# Altium project CG_LNA.PrjPcb
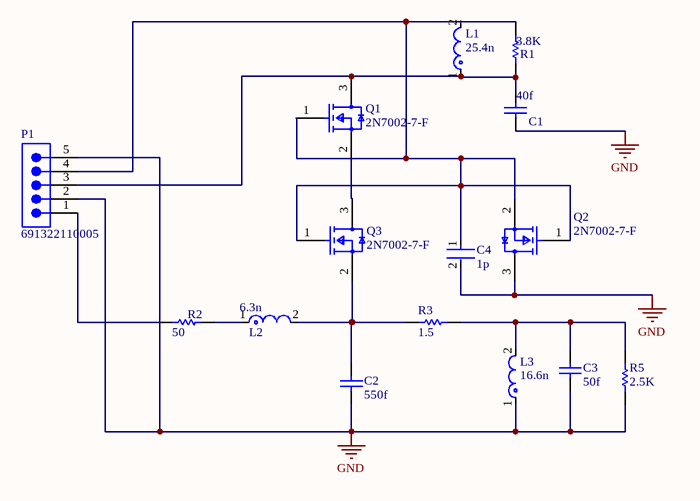
[diagram p0: Sheet1.SchDoc]
1 sheet, 15 parts. Net scope: global (net labels, ports and power ports of the same name join across sheets).
Board file: PCB2.PcbDoc

## Sheet Sheet1.SchDoc
size A; SheetNumber: 1; SheetTotal: 1

### Parts
C1  40f  [CAPC1005X55X25ML05T10]
C2  550f  [CAPC1005X55X25ML05T10]
C3  50f  [CAPC1608X90X35NL10T15]
C4  1p  [FP-GJM155-0_05-IPC_B]
L1  25.4n  [FP-LQP03TG_02-MFG]
L2  6.3n  [FP-LQP03TG_02-MFG]
L3  16.6n  [FP-LQP03TG_02-MFG]
P1  691322110005  [691322110005]
Q1  2N7002-7-F  [FP-SOT23-MFG]
Q2  2N7002-7-F  [FP-SOT23-MFG]
Q3  2N7002-7-F  [FP-SOT23-MFG]
R1  3.8K  [RESC1005X40X25LL05T05]
R2  50  [RESC1005X40X25LL05T05]
R3  1.5  [RESC1005X40X25LL05T05]
R5  2.5K  [RESC1005X40X25LL05T05]

### Nets
GND: C1.1 C2.1 C3.1 C4.2 L3.1 P1.2 P1.5 Q2.3(D) R5.1
NetC1_2: C1.2 L1.1 P1.3 Q1.3(D) R1.1
NetC2_2: C2.2 L2.2 Q3.2(S) R3.1
NetC3_2: C3.2 L3.2 R3.2 R5.2
NetC4_1: C4.1 P1.4 Q1.1(G) Q2.1(G) Q2.2(S) Q3.1(G) R1.2
NetL2_1: L2.1 R2.2
NetP1_1: P1.1 R2.1
NetQ1_2: Q1.2(S) Q3.3(D)

Not connected (* = marked no-connect by the designer): L1 2

### Library data of the parts
C1 C2 = CMP-2008-04284-1: Part Number: GRM1555C1H1R3CA01D; Manufacturer: Murata
C3 = CMP-2006-02422-1: Part Number: GQM1885C1H120JB01D; Manufacturer: Murata
C4 = CMP-2008-03808-2: Multi-Layer Ceramic Capacitor 1pF C0G  ±0.1pF 0402 Paper T/R; Temperature Coefficient: 30ppm/°C; Voltage Rating (DC): 50V; REACH SVHC: No SVHC; Packaging: Tape and Reel; Width: 0.02inch; Package Quantity: 10000; Min Operating Temperature: -55°C; Case Code (Imperial): 0402; Lead Pitch: 0.3mm; Capacitance: 1pF; Length: 1mm; Max Operating Temperature: 125°C; Depth: 0.5mm; Thickness: 0.022inch; Case Code (Metric): 1005; Lead Free: Lead Free; Voltage: 50V; Mount: Surface Mount; Number of Pins: 2; Termination: SMD/SMT; Radiation Hardening: No; Dielectric: C0G; Case/Package: 0402; Voltage Rating: 50V; Height: 0.5mm
L1-L3 = CMP-06042-014154-1: Film type RF Inductor 3.3nH ±0.1nH 450mA 0.25Ω 0201 (0603); Tolerance: 3%; DC Resistance (DCR): 250mR; Shielding: Unshielded; Q Factor: 14; Current: 300mA; Self Resonant Frequency: 8GHz; Test Frequency: 500MHz; Core Material: Non-Magnetic; Mount: Surface Mount; Radiation Hardening: No; Width: 0.012inch; Case Code (Imperial): 0201; Current Rating: 450mA; Height: 0.012inch; Height - Seated (Max): 0.013inch; Package Quantity: 15000; Termination: SMD/SMT; Inductance: 3.3nH; Max Operating Temperature: 125°C; DC Current: 450mA; Min Operating Temperature: -55°C; Max DC Current: 450mA; Packaging: Tape and Reel; Resistor Type: Thin Film; Case/Package: 0201; Case Code (Metric): 0603; Lead Free: Lead Free; Depth: 0.33mm; Length: 0.024inch; Military Standard: Not
P1 = CMP-1502-01794-2: NexarPartId: 18818349; Pitch: 3.5052mm; Current: 10A; Gender: Male; Number of Contacts: 5; Voltage: 300V; Number of Levels: 1; REACH SVHC: Unknown; Number of Rows: 1; Mount: Through Hole; Termination: Solder; Packaging: Box; Lead Pitch: 3.5mm; Contact Gender: Male; Number of Pins: 5; Contact Material: Brass; RoHS: Compliant; Color: Green; Length: 10.5mm; Width: 18.6mm; Number of Positions Per Level: 5; Height: 9.2mm
Q1-Q3 = CMP-2000-04929-2: MOSFET N-CH 60V 115MA SOT23-3; Turn-On Delay Time: 7ns; Turn-Off Delay Time: 11ns; Drain to Source Resistance: 7.5R; Rise Time: 3ns; Drain to Source Breakdown Voltage: 70V; Input Capacitance: 50pF; Number of Elements: 1; Power Dissipation: 540mW; Max Power Dissipation: 300mW; Fall Time: 5.6ns; Gate to Source Voltage (Vgs): 20V; Threshold Voltage: 2.5V; Element Configuration: Single; Termination: SMD/SMT; Weight: 0.000282oz; Radiation Hardening: No; Max Operating Temperature: 150°C; On-State Resistance: 7.5R; Mount: Surface Mount; Current Rating: 115mA; Contact Plating: Tin; Lead Free: Lead Free; Min Operating Temperature: -55°C; Number of Pins: 3; REACH SVHC: No SVHC; Drain to Source Voltage (Vdss): 60V; Width: 1.3mm; Package Quantity: 3000; Length: 2.9mm; Case/Package: SOT-23; Number of Channels: 1; Dual Supply Voltage: 60V; Packaging: Tape and Reel; Height: 1mm; Voltage Rating (DC): 60V; Nominal Vgs: 2.5V; Continuous Drain Current (ID): 115mA; Voltage: 60V; Rds On Max: 7.5R
R1-R3 R5 = CMP-2000-07451-1: Chip Resistor, 0 Ohm, 0.1 W, -55 to 155 degC, 0402 (1005 Metric), RoHS, Tape and Reel; Manufacturer: Panasonic; Voltage Rating (DC): 50V; Temperature Coefficient: 600ppm/��C; Max Power Dissipation: 100mW; Resistance: 0mOhm; Tolerance: 5%; Number of Terminations: 2; Mount: SurfaceMount; Height: 0.35mm; Packaging: TapeandReel; Contact Plating: Tin; Manufacturer URL: http://www.panasonic.com/; Composition: ThickFilm; Max Operating Temperature: 155degC; REACH SVHC: NoSVHC; Case/Package: 0402; Package Reference: 402; Depth: 0.5mm; Package Description: 2-Pin Surface Mount Device, Body 1 x 0.5 mm; Datasheet URL: https://industrial.panasonic.com/cdbs/www-data/pdf/RDA0000/AOA0000C301.pdf; RoHSCompliant: True; Case Code (Imperial): 0402; Military Standard: Not; Min Operating Temperature: -55degC; Power Rating: 100mW; Datasheet Version: 03/2015; Length: 1mm; Case Code (Metric): 1005; Termination: SMD/SMT; Mounting Technology: SurfaceMount; Voltage Rating: 50V; Width: 0.02inch; Package Quantity: 1; Lead Free: LeadFree; Radiation Hardening: No